# EAGLE design single_hr_mux_d1 (EAGLE 9.6.1)
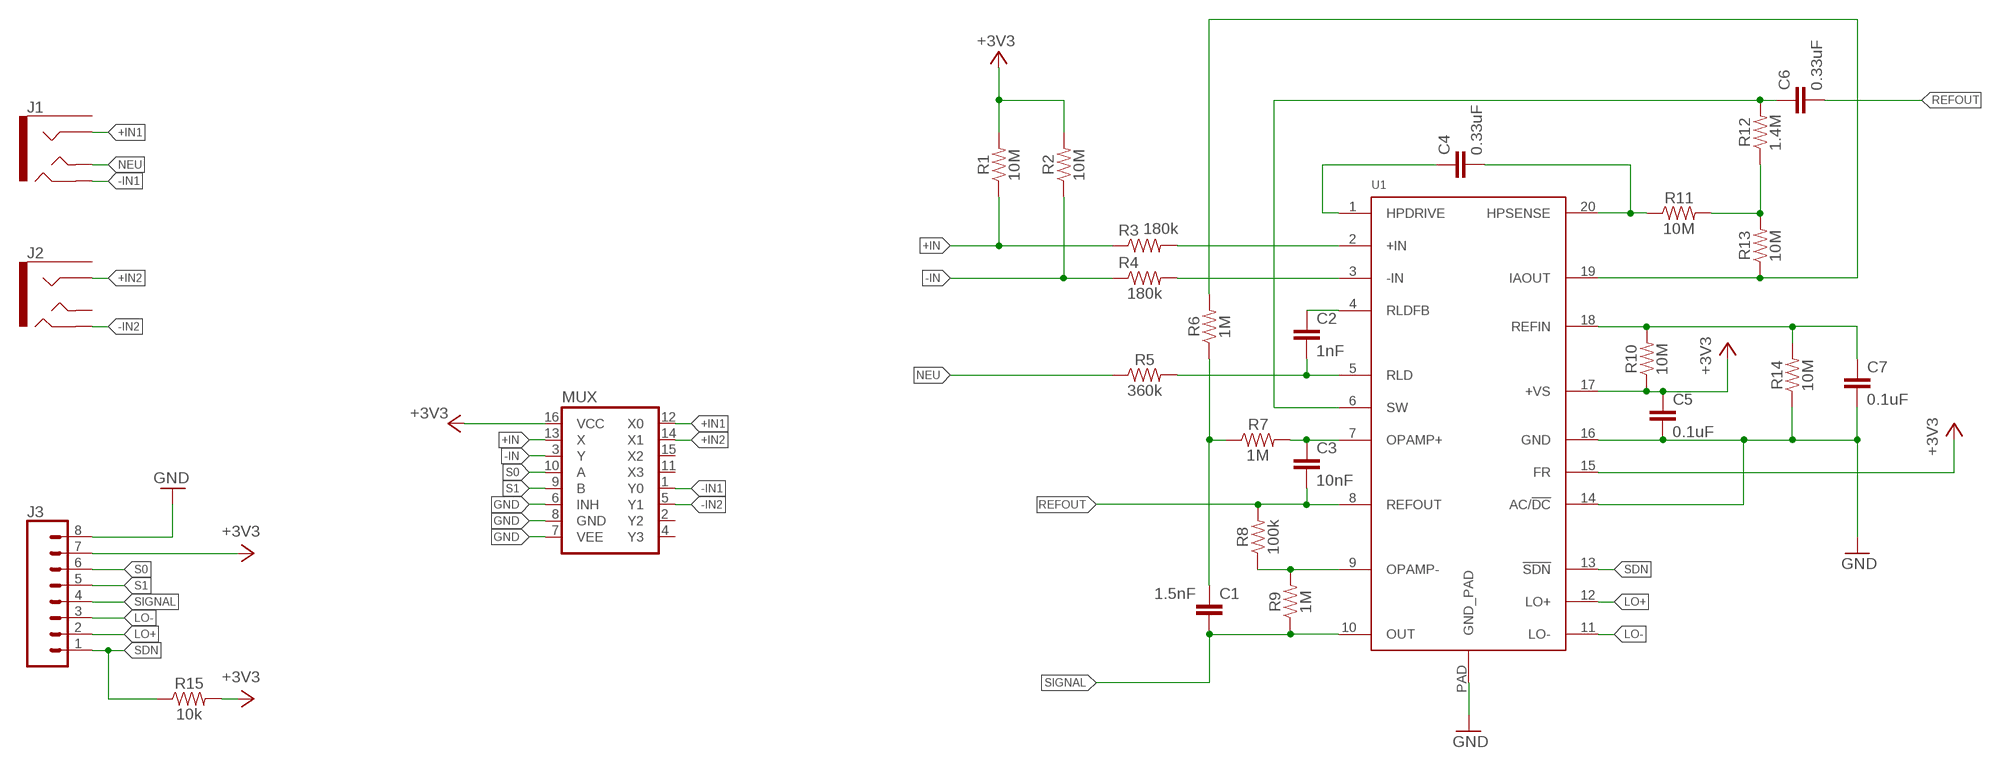
[diagram p0: schematic, sheet 1]

## Parts
C1  1.5nF  CAP0603-CAP  [0603-CAP]
C2  1nF  CAP0603-CAP  [0603-CAP]
C3  10nF  CAP0603-CAP  [0603-CAP]
C4  0.33uF  CAP0805  [0805]
C5  0.1uF  CAP0603-CAP  [0603-CAP]
C6  0.33uF  CAP0805  [0805]
C7  0.1uF  CAP0603-CAP  [0603-CAP]
J1  AUDIO_JACK_TRRSSMD_RA  [AUDIO_JACK_3.5MM_TRRS_SMD_RA]
J2  AUDIO_JACK_TRRSSMD_RA  [AUDIO_JACK_3.5MM_TRRS_SMD_RA]
J3  CONN_08"  [1X08]
MUX  74HC4052D  [SO16]
R1  10M  RESISTOR0603  [0603]
R2  10M  RESISTOR0603  [0603]
R3  180k  RESISTOR0603  [0603]
R4  180k  RESISTOR0603  [0603]
R5  360k  RESISTOR0603  [0603]
R6  1M  RESISTOR0603  [0603]
R7  1M  RESISTOR0603  [0603]
R8  100k  RESISTOR0603  [0603]
R9  1M  RESISTOR0603  [0603]
R10  10M  RESISTOR0603  [0603]
R11  10M  RESISTOR0603  [0603]
R12  1.4M  RESISTOR0603  [0603]
R13  10M  RESISTOR0603  [0603]
R14  10M  RESISTOR0603  [0603]
R15  10k  10KOHM-0603-1/10W-1%  [0603]
U1  AD8232ACPZ-R7  AD8232  [LFCSP_20]

## Nets
+3V3: C5.1 J3.7 MUX.16(VCC) R1.2 R2.2 R10.1 R15.2 U1.15(FR) U1.17(+VS)
+IN: MUX.13(X) R1.1 R3.1
+IN1: J1.RING1 MUX.12(X0)
+IN2: J2.RING1 MUX.14(X1)
-IN: MUX.3(Y) R2.1 R4.1
-IN1: J1.RING2 MUX.1(Y0)
-IN2: J2.RING2 MUX.5(Y1)
GND: C5.2 C7.2 J3.8 MUX.6(INH) MUX.7(VEE) MUX.8(GND) R14.1 U1.14(AC/!DC) U1.16(GND) U1.PAD(GND_PAD)
LO+: J3.2 U1.12(LO+)
LO-: J3.3 U1.11(LO-)
N$1: R8.1 R9.2 U1.9(OPAMP-)
N$3: R3.2 U1.2(+IN)
N$4: R4.2 U1.3(-IN)
N$6: C1.1 R6.1 R7.1
N$7: C3.1 R7.2 U1.7(OPAMP+)
N$8: C2.1 U1.4(RLDFB)
N$9: C2.2 R5.2 U1.5(RLD)
N$10: R6.2 R13.1 U1.19(IAOUT)
N$11: C6.1 R12.2 U1.6(SW)
N$12: C7.1 R10.2 R14.2 U1.18(REFIN)
N$13: R11.2 R12.1 R13.2
N$14: C4.2 R11.1 U1.20(HPSENSE)
N$15: C4.1 U1.1(HPDRIVE)
NEU: J1.TIP R5.1
REFOUT: C3.2 C6.2 R8.2 U1.8(REFOUT)
S0: J3.6 MUX.10(A)
S1: J3.5 MUX.9(B)
SDN: J3.1 R15.1 U1.13(!SDN)
SIGNAL: C1.2 J3.4 R9.1 U1.10(OUT)
Unconnected: J1.EARTH J2.EARTH J2.TIP MUX.2(Y2) MUX.4(Y3) MUX.11(X3) MUX.15(X2)

## Library data of the parts
C1-C7 = SparkFun-Passives:CAP: Capacitor Standard 0603 ceramic capacitor, and 0.1" leaded capacitor.
J1 J2 = SparkFun-Connectors:AUDIO_JACK_TRRS: Audio Jack - 3.5mm TRRS (SMD) This is a 3.5mm TRRS SMD audio jack. TRRS connectors are the audio-style connectors that you see on some phones, MP3 players and development boards. TRRS stands for “tip, ring, ring, sleeve,” which reflects that this has three conductors and a ground. SparkFun Products: Audio Jack <https://www.sparkfun.com/products/12639> mbed Starter Kit <https://www.sparkfun.com/products/12968> SparkFun TRRS 3.5mm Jack Breakout <https://www.sparkfun.com/products/11570>; PROD_ID: CONN-10676; SF_ID: PRT-12639
J3 = SparkFun-Connectors:CONN_08: Multi connection point. Often used as Generic Header-pin footprint for 0.1 inch spaced/style header connections On any of the 0.1 inch spaced packages, you can populate with these: Break Away Headers - Straight <https://www.sparkfun.com/products/116> (PRT-00116) Break Away Male Headers - Right Angle <https://www.sparkfun.com/products/553> (PRT-00553) Female Headers <https://www.sparkfun.com/products/115> (PRT-00115) Break Away Headers - Machine Pin <https://www.sparkfun.com/products/117> (PRT-00117) Break Away Female Headers - Swiss Machine Pin <https://www.sparkfun.com/products/743> (PRT-00743) Arduino Stackable Header - 8 Pin <https://www.sparkfun.com/products/9279> (PRT-09279) For SCREWTERMINALS and SPRING TERMINALS visit here: Screw Terimnals on SparkFun.com <https://www.sparkfun.com/search/results?term=Screw+Terminals> (5mm/3.5mm/2.54mm spacing) This device is also useful as a general connection point to wire up your design to another part of your project. Our various solder wires solder well into these plated through hole pads. Hook-Up Wire - Assortment (Stranded, 22 AWG) <https://www.sparkfun.com/products/11375> (PRT-11375) Hook-Up Wire - Assortment (Solid Core, 22 AWG) <https://www.sparkfun.com/products/11367> (PRT-11367) View the entire wire category on our website here <https://www.sparkfun.com/categories/141> Special notes: Molex polarized connector foot print use with SKU : PRT-08231 with associated crimp pins and housings. 1MM SMD Version SKU: PRT-10208 NOTES ON THE VARIANTS LOCK and LOCK_LONGPADS... This footprint was designed to help hold the alignment of a through-hole component (i.e. 6-pin header) while soldering it into place. You may notice that each hole has been shifted either up or down by 0.005 of an inch from it's more standard position (which is a perfectly straight line). This slight alteration caused the pins (the squares in the middle) to touch the edges of the holes. Because they are alternating, it causes a "brace" to hold the component in place. 0.005 has proven to be the perfect amount of "off-center" position when using our standard breakaway headers. Although looks a little odd when you look at the bare footprint, once you have a header in there, the alteration is very hard to notice. Also,if you push a header all the way into place, it is covered up entirely on the bottom side.; PROD_ID: CONN-08438
MUX = SparkFun-IC-Logic:74*4052: Dual 4:1 Analog Mux Dual four-channel analog MULTIPLEXER / DEMULTIPLEXER SparkFun Products SparkFun Vernier Interface Shield <https://www.sparkfun.com/products/12858> (DEV-12858); PROD_ID: IC-13103
R1-R14 = SparkFun-Resistors:RESISTOR: Generic Resistor Package
R15 = SparkFun-Resistors:10KOHM: 10kΩ resistor A resistor is a passive two-terminal electrical component that implements electrical resistance as a circuit element. Resistors act to reduce current flow, and, at the same time, act to lower voltage levels within circuits. - Wikipedia; PROD_ID: RES-00824
U1 = SparkFun-Sensors:AD8232: AD8232 Single Lead Heart Rate Monitor IC Datasheet <https://cdn.sparkfun.com/datasheets/Sensors/Biometric/AD8232.pdf> SparkFun Products SparkFun Single Lead Heart Rate Monitor - AD8232 <https://www.sparkfun.com/products/12650> (SEN-12650); PROD_ID: IC-11886

## Board
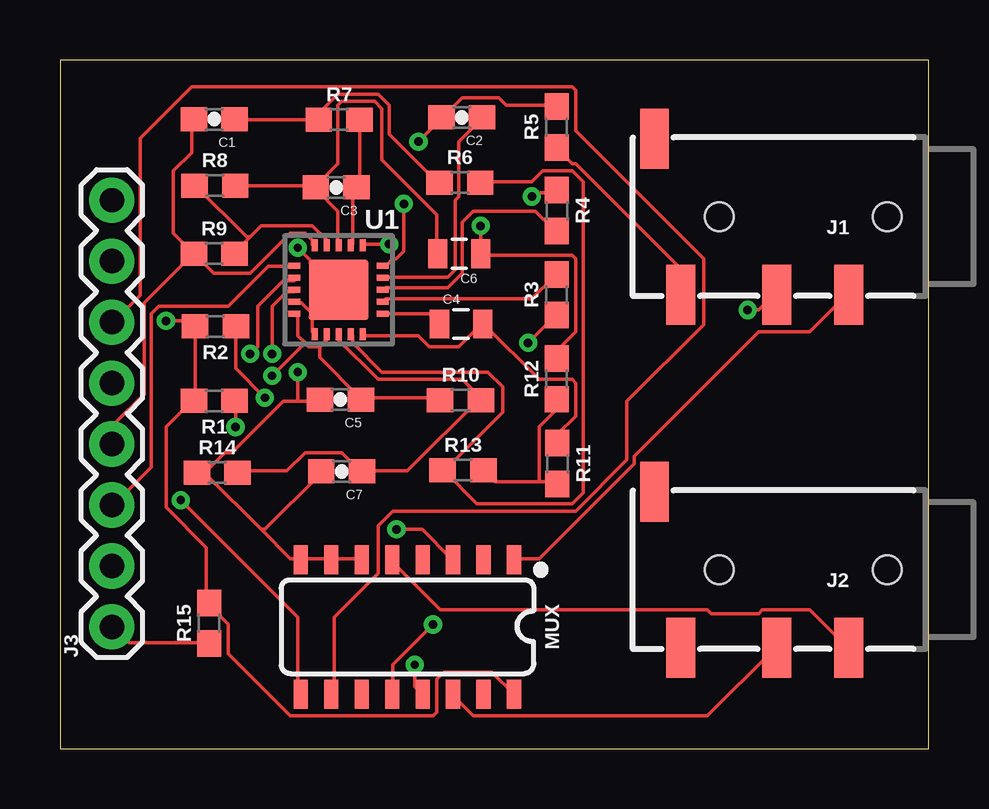
[diagram p1: board, top side]
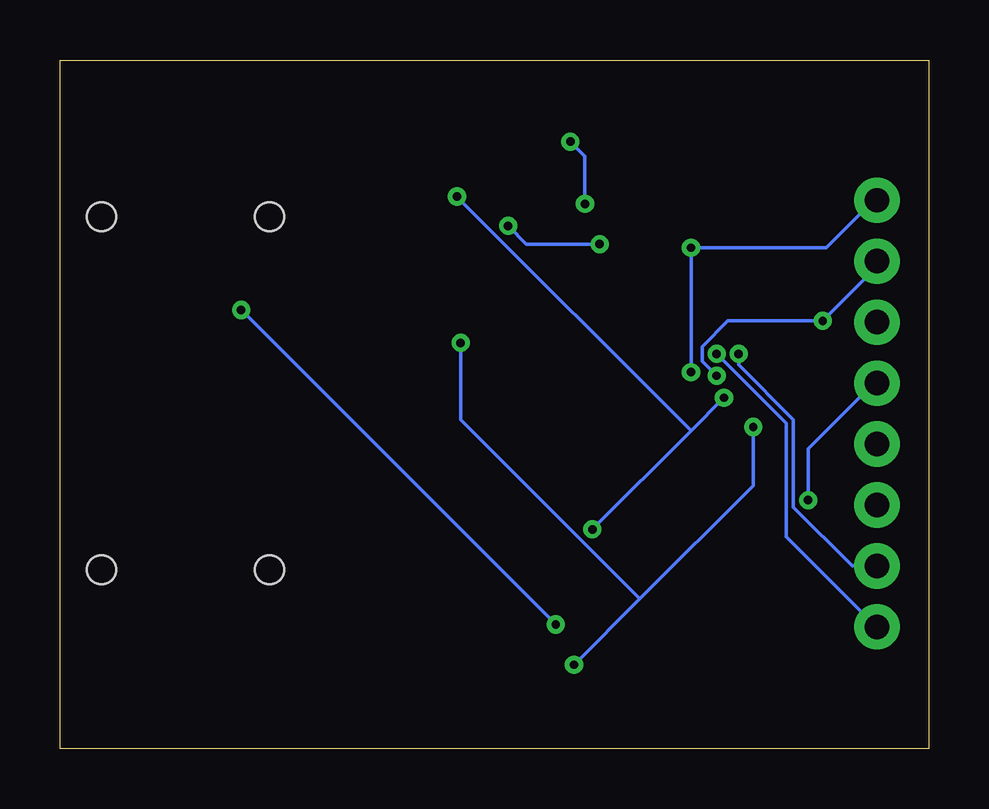
[diagram p2: board, bottom side, seen from below]

Size 36.2 x 28.7 mm. Coordinates in mm from the lower left corner, seen from the top.
Outline: 0,0 36.2,0 36.2,28.7 0,28.7 0,0
Copper layers (1*16): Top 0.035mm / dielectric 1.5mm / Bottom 0.035mm
Design rules "default": minimum track width 6mil, minimum drill 0.35mm, track to track 6mil, track to pad 6mil, pad to pad 6mil, via to via 6mil, smd to smd 6mil, copper to edge 40mil, drill to drill 6mil, minimum pad ring 10mil, minimum via ring 8mil, stop-mask expansion 4mil, vias tented up to drill 0mil, thermal gap 10mil

### Footprints (pad centres in the part's own frame; a part is rotated, then mirrored left to right if it is on the bottom)
0603-CAP = smd 1.1 x 1: 1 -0.85,0; 2 0.85,0
0805 = smd 0.8 x 1.2: 1 -0.9,0; 2 0.9,0
AUDIO_JACK_3.5MM_TRRS_SMD_RA = smd 1.2 x 2.5: EARTH 11.3,-3.25; RING1 6.2,3.25; RING2 3.2,3.25; TIP 10.2,3.25 | hole 1.2: 1.6,0; 8.6,0
1X08 = drill 1.016 pad 1.88: 1 0,0; 2 2.54,0; 3 5.08,0; 4 7.62,0; 5 10.16,0; 6 12.7,0; 7 15.24,0; 8 17.78,0
SO16 = smd 0.6 x 1.2: 1 -4.445,-2.8; 2 -3.175,-2.8; 3 -1.905,-2.8; 4 -0.635,-2.8; 5 0.635,-2.8; 6 1.905,-2.8; 7 3.175,-2.8; 8 4.445,-2.8; 9 4.445,2.8; 10 3.175,2.8; 11 1.905,2.8; 12 0.635,2.8; 13 -0.635,2.8; 14 -1.905,2.8; 15 -3.175,2.8; 16 -4.445,2.8
0603 = smd 1.1 x 1: 1 -0.85,0; 2 0.85,0
LFCSP_20 = smd 0.5 x 0.25: 1 -1.85,1; 2 -1.85,0.5; 3 -1.85,0; 4 -1.85,-0.5; 5 -1.85,-1; 11 1.85,-1; 12 1.85,-0.5; 13 1.85,0; 14 1.85,0.5; 15 1.85,1 | smd 0.25 x 0.5: 6 -1,-1.85; 7 -0.5,-1.85; 8 0,-1.85; 9 0.5,-1.85; 10 1,-1.85; 16 1,1.85; 17 0.5,1.85; 18 0,1.85; 19 -0.5,1.85; 20 -1,1.85 | smd 2.5 x 2.5: PAD 0,0

### Placement (x,y rotation side)
C1  6.43,26.24 180 top
C2  16.74,26.31 180 top
C3  11.51,23.39 180 top
C4  16.71,17.7 0 top
C5  11.68,14.55 180 top
C6  16.64,20.62 180 top
C7  11.73,11.56 180 top
J1  36.07,22.17 180 top
J2  36.07,7.47 180 top
J3  2.16,5.08 90 top
MUX  14.48,5.08 180 top
R1  6.43,14.5 180 top
R2  6.48,17.6 180 top
R3  20.7,18.92 90 top
R4  20.7,22.43 270 top
R5  20.7,25.91 90 top
R6  16.66,23.6 0 top
R7  11.63,26.21 0 top
R8  6.45,23.47 0 top
R9  6.43,20.62 0 top
R10  16.69,14.53 0 top
R11  20.73,11.89 270 top
R12  20.7,15.42 90 top
R13  16.79,11.61 0 top
R14  6.55,11.51 0 top
R15  6.22,5.23 90 top
U1  11.61,19.13 180 top

### Tracks (layer width: path | path; a pad name or v marks a point on that pad's centre or on a via)
+3V3  (via drill 0.35)
  Top 0.152: 10.21,16.92 10.36,16.76 10.82,16.76 | 10.21,16.92 9.91,17.22 9.91,18.14 U1.15 | 10.82,16.76 11.12,17.07 11.12,17.22 U1.17 | R10.1 15.7,14.63 12.65,14.63 C5.1 12.5,14.63 10.82,16.31 10.82,16.76 | MUX.16 18.9,2.29 17.98,3.2 16,3.2 15.7,2.9 15.7,1.52 15.54,1.37 9.6,1.37 7.01,3.96 7.01,5.18 6.25,5.94 R15.2 6.1,6.1 6.1,8.38 4.42,10.06 4.42,13.41 5.49,14.48 R1.2 5.64,14.63 5.64,17.53 R2.2 5.49,17.68 5.33,17.83 v4.42,17.83 | v8.84,15.54 10.21,16.92
  Bottom 0.152: J3.7 2.29,20.27 2.29,19.96 v4.42,17.83 8.38,17.83 9.45,16.76 9.45,16.15 v8.84,15.54
+IN  (via drill 0.35)
  Top 0.152: v7.32,13.41 7.32,14.48 R1.1 | v14.78,3.5 14.78,2.59 15.09,2.29 MUX.13 | v19.51,16.92 20.57,17.98 R3.1
  Bottom 0.152: v7.32,13.41 7.32,10.97 12.04,6.25 | v14.78,3.5 12.04,6.25 | v19.51,16.92 19.51,13.72 12.04,6.25
+IN1  (via drill 0.35)
  Top 0.152: v15.54,5.18 13.87,3.5 13.87,2.29 MUX.12 | v28.65,18.29 29.11,18.29 29.72,18.9 J1.RING1
  Bottom 0.152: v28.65,18.29 v15.54,5.18
+IN2
  Top 0.152: MUX.14 16.46,2.13 17.22,1.37 26.98,1.37 29.72,4.12 J2.RING1
-IN  (via drill 0.35)
  Top 0.152: v8.53,14.63 7.32,15.85 7.32,17.53 R2.1 | v14.02,9.14 15.09,9.14 16.31,7.92 MUX.3 | v19.66,23.01 19.81,23.16 20.57,23.16 R4.1
  Bottom 0.152: v14.02,9.14 9.91,13.26 | 9.91,13.26 v8.53,14.63 | 9.91,13.26 v19.66,23.01
-IN1
  Top 0.152: MUX.1 19.05,7.92 19.96,7.92 23.93,11.89 23.93,12.19 29.11,17.37 31.24,17.37 32.77,18.9 J1.RING2
-IN2
  Top 0.152: MUX.5 13.87,7.77 15.85,5.79 26.98,5.79 27.13,5.64 29.11,5.64 29.26,5.79 31.24,5.79 32.77,4.27 J2.RING2
GND  (via drill 0.35)
  Top 0.152: MUX.6 12.5,7.92 11.43,7.92 MUX.7 11.28,7.92 10.06,7.92 MUX.8 9.91,7.92 9.6,7.92 8.38,9.14 | 5.94,11.43 6.1,11.43 8.38,9.14 | 5.94,11.43 5.79,11.43 R14.1 5.94,11.43 | 8.38,9.14 8.53,9.14 10.82,11.43 C7.2 | 9.91,14.48 9.3,14.48 7.16,12.34 6.86,12.34 5.94,11.43 | 9.91,14.48 10.82,14.48 C5.2 | 10.52,18.14 10.06,18.59 9.91,18.59 U1.14 | 10.52,18.14 10.52,17.37 U1.16 | 11.58,19.2 10.52,18.14 | v9.91,20.88 11.58,19.2 | 11.58,19.2 U1.PAD | v9.91,15.7 9.91,14.48
  Bottom 0.152: J3.8 2.29,22.86 4.27,20.88 v9.91,20.88 v9.91,15.7
LO+  (via drill 0.35)
  Top 0.152: v7.92,16.46 8.23,16.76 8.23,18.44 9.3,19.51 9.75,19.51 U1.12
  Bottom 0.152: v7.92,16.46 7.92,16 5.64,13.72 5.64,10.06 3.2,7.62 J3.2
LO-
  Top 0.152: U1.11 9.75,20.12 8.69,20.12 7.01,18.44 4.12,18.44 3.81,18.14 3.81,11.73 2.29,10.21 J3.3
N$1
  Top 0.152: 7.92,21.34 7.32,20.73 R9.2 | 7.92,21.34 8.38,21.79 10.52,21.79 11.12,21.18 11.12,21.03 U1.9 | 7.92,21.34 7.77,21.34 5.64,23.47 R8.1
N$3
  Top 0.152: U1.2 13.56,18.75 19.66,18.75 20.57,19.66 R3.2
N$4
  Top 0.152: U1.3 13.56,19.2 16.15,19.2 16.76,19.81 16.76,21.95 17.22,22.4 19.81,22.4 20.57,21.64 R4.2
N$6
  Top 0.152: 10.52,26.21 7.32,26.21 C1.1 | R7.1 10.76,26.19 10.49,26.19 10.52,26.21 | 10.52,26.21 11.58,27.28 13.26,27.28 13.72,26.82 13.72,25.6 15.7,23.62 R6.1
N$7
  Top 0.152: U1.7 12.19,21.03 12.19,23.16 12.34,23.32 C3.1 12.5,23.47 12.5,26.21 R7.2
N$8
  Top 0.152: U1.4 13.56,19.66 16.15,19.66 16.46,19.96 16.46,22.86 16.61,23.01 16.61,25.3 17.53,26.21 C2.1
N$9  (via drill 0.35)
  Top 0.152: v14.33,22.71 14.33,20.73 14.02,20.42 13.87,20.42 13.56,20.12 U1.5 | v14.94,25.3 15.85,26.21 C2.2 16,26.36 16.76,27.13 18.29,27.13 18.59,26.82 20.57,26.82 R5.2
  Bottom 0.152: v14.33,22.71 14.33,24.69 v14.94,25.3
N$10
  Top 0.152: 16,11.58 18.44,14.02 18.44,15.09 17.83,15.7 13.41,15.7 12.19,16.92 12.19,17.22 U1.19 | 16,11.58 17.37,10.21 21.34,10.21 21.79,10.67 21.79,23.62 21.34,24.08 20.12,24.08 19.66,23.62 17.53,23.62 R6.2 | 16,11.58 R13.1
N$11  (via drill 0.35)
  Top 0.152: v13.72,21.03 12.65,21.03 U1.6 | v17.53,21.79 17.53,20.73 C6.1 17.68,20.57 21.34,20.57 21.49,20.42 21.49,17.37 20.73,16.61 20.73,16.31 R12.2
  Bottom 0.152: v13.72,21.03 16.76,21.03 v17.53,21.79
N$12
  Top 0.152: R14.2 7.47,11.58 9.45,11.58 10.21,12.34 11.73,12.34 12.5,11.58 C7.1 12.65,11.58 14.48,11.58 17.53,14.63 | 17.53,14.63 16.76,15.39 13.26,15.39 11.58,17.07 11.58,17.22 U1.18 | 17.53,14.63 R10.2
N$13
  Top 0.152: 19.96,11.12 18.14,11.12 17.68,11.58 R13.2 | 19.96,11.12 20.73,11.12 R11.2 | 19.96,11.12 19.96,13.41 20.57,14.02 20.57,14.48 R12.1
N$14
  Top 0.152: U1.20 12.65,17.22 14.94,17.22 15.39,16.76 16.61,16.76 17.53,17.68 C4.2 17.68,17.68 19.96,15.39 21.34,15.39 21.49,15.24 21.49,13.87 20.73,13.11 R11.1
N$15
  Top 0.152: U1.1 13.56,18.14 15.39,18.14 15.7,17.83 C4.1
NEU
  Top 0.152: R5.1 20.73,24.99 21.34,24.38 21.49,24.38 25.76,20.12 25.76,19.05 J1.TIP
REFOUT
  Top 0.152: U1.8 11.58,21.03 11.58,22.4 10.67,23.32 C3.2 | R8.2 10.52,23.47 C3.2 | C6.2 15.7,20.73 15.7,22.25 13.41,24.54 13.41,26.67 13.11,26.98 11.73,26.98 11.58,26.82 11.58,24.38 10.67,23.47 C3.2
S0
  Top 0.152: MUX.10 11.43,2.29 11.43,5.49 13.26,7.32 13.26,9.3 13.87,9.91 21.49,9.91 23.62,12.04 23.62,14.48 26.82,17.68 26.82,20.42 21.49,25.76 21.49,27.43 21.34,27.58 5.49,27.58 3.35,25.45 3.35,18.9 2.29,17.83 J3.6
S1  (via drill 0.35)
  Top 0.152: v5.03,10.36 9.91,5.49 9.91,2.29 MUX.9
  Bottom 0.152: v5.03,10.36 5.03,12.5 2.29,15.24 J3.5
SDN  (via drill 0.35)
  Top 0.152: v8.84,16.46 8.84,18.44 9.45,19.05 9.75,19.05 U1.13 | R15.1 6.1,4.42 2.9,4.42 2.29,5.03 J3.1
  Bottom 0.152: v8.84,16.46 5.94,13.56 5.94,8.84 2.29,5.18 J3.1
SIGNAL
  Top 0.152: U1.10 10.52,21.03 10.52,21.18 10.21,21.49 9.6,21.49 7.92,19.81 6.4,19.81 5.64,20.57 R9.1 | C1.2 5.49,26.21 5.49,24.84 4.72,24.08 4.72,21.49 5.49,20.73 R9.1 | J3.4 2.29,12.8 2.29,13.56 3.5,14.78 3.5,18.59 5.49,20.57 R9.1